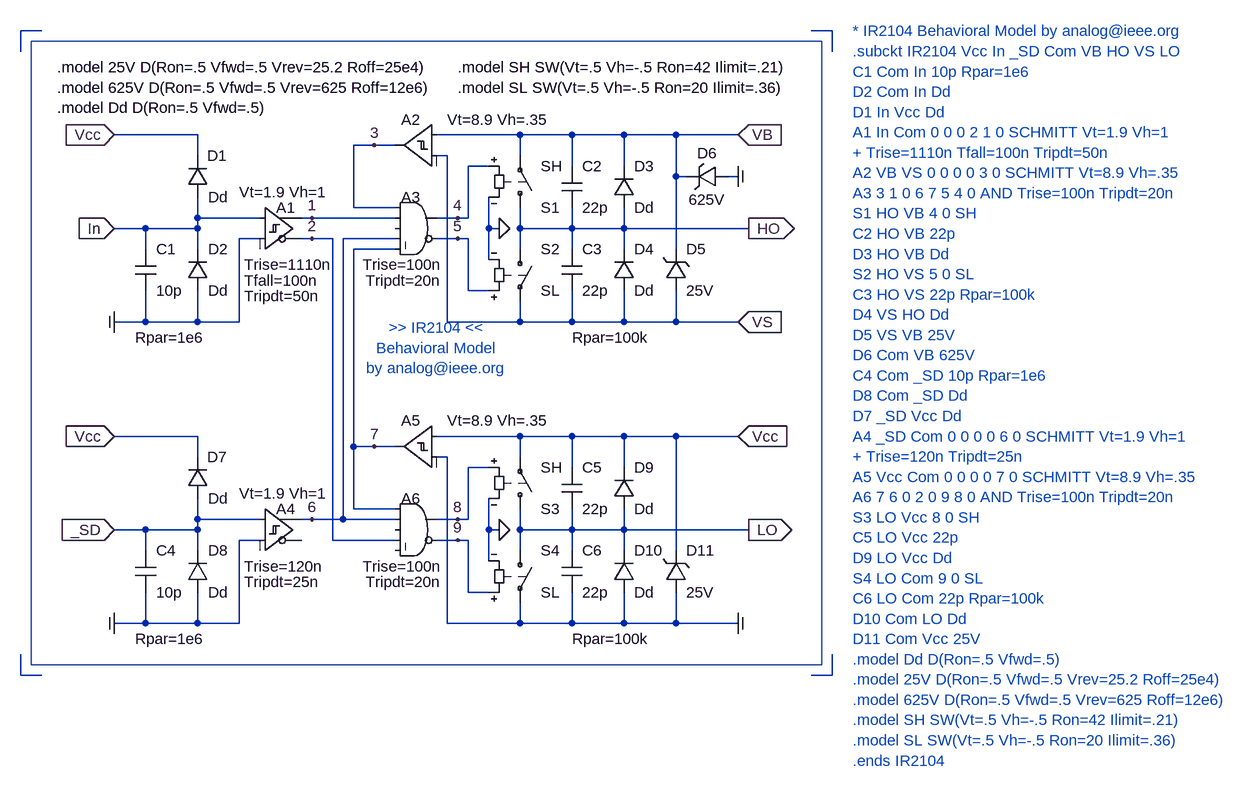
[diagram p0: schematic ir2104.asc]
ir2104.asc, the LTspice schematic file:
Version 4
SHEET 1 1888 1048
WIRE -400 -560 -400 -592
WIRE -400 400 -400 368
WIRE -368 -592 -400 -592
WIRE -368 400 -400 400
WIRE -208 -288 -256 -288
WIRE -208 -256 -208 -288
WIRE -208 -144 -256 -144
WIRE -208 -144 -208 -192
WIRE -208 176 -256 176
WIRE -208 208 -208 176
WIRE -208 320 -256 320
WIRE -208 320 -208 272
WIRE -128 -432 -256 -432
WIRE -128 -400 -128 -432
WIRE -128 -304 -128 -336
WIRE -128 -288 -208 -288
WIRE -128 -288 -128 -304
WIRE -128 -256 -128 -288
WIRE -128 -144 -208 -144
WIRE -128 -144 -128 -192
WIRE -128 32 -256 32
WIRE -128 64 -128 32
WIRE -128 160 -128 128
WIRE -128 176 -208 176
WIRE -128 176 -128 160
WIRE -128 208 -128 176
WIRE -128 320 -208 320
WIRE -128 320 -128 272
WIRE -64 -144 -128 -144
WIRE -64 -144 -64 -272
WIRE -64 320 -128 320
WIRE -64 320 -64 192
WIRE -32 -304 -128 -304
WIRE -32 -272 -64 -272
WIRE -32 160 -128 160
WIRE -32 192 -64 192
WIRE 48 -304 32 -304
WIRE 48 -272 32 -272
WIRE 48 160 32 160
WIRE 80 -272 48 -272
WIRE 80 192 80 -272
WIRE 96 160 48 160
WIRE 96 160 96 -272
WIRE 112 -320 112 -416
WIRE 112 48 112 -256
WIRE 112 144 112 48
WIRE 144 -416 112 -416
WIRE 144 48 112 48
WIRE 176 -416 144 -416
WIRE 176 -320 112 -320
WIRE 176 -304 48 -304
WIRE 176 -272 96 -272
WIRE 176 -256 112 -256
WIRE 176 48 144 48
WIRE 176 144 112 144
WIRE 176 160 96 160
WIRE 176 192 80 192
WIRE 256 -400 240 -400
WIRE 256 -144 256 -400
WIRE 256 64 240 64
WIRE 256 320 256 64
WIRE 272 -304 240 -304
WIRE 272 -272 240 -272
WIRE 272 160 240 160
WIRE 272 192 240 192
WIRE 288 -304 272 -304
WIRE 288 -304 288 -384
WIRE 288 -272 272 -272
WIRE 288 -192 288 -272
WIRE 288 160 272 160
WIRE 288 160 288 80
WIRE 288 192 272 192
WIRE 288 272 288 192
WIRE 320 -384 288 -384
WIRE 320 -288 320 -336
WIRE 320 -240 320 -288
WIRE 320 -192 288 -192
WIRE 320 80 288 80
WIRE 320 176 320 128
WIRE 320 224 320 176
WIRE 320 272 288 272
WIRE 336 -288 320 -288
WIRE 336 176 320 176
WIRE 368 -432 240 -432
WIRE 368 -400 368 -432
WIRE 368 -288 368 -320
WIRE 368 -256 368 -288
WIRE 368 -144 256 -144
WIRE 368 -144 368 -176
WIRE 368 32 240 32
WIRE 368 64 368 32
WIRE 368 176 368 144
WIRE 368 208 368 176
WIRE 368 320 256 320
WIRE 368 320 368 288
WIRE 448 -432 368 -432
WIRE 448 -384 448 -432
WIRE 448 -288 368 -288
WIRE 448 -288 448 -320
WIRE 448 -256 448 -288
WIRE 448 -144 368 -144
WIRE 448 -144 448 -192
WIRE 448 32 368 32
WIRE 448 80 448 32
WIRE 448 176 368 176
WIRE 448 176 448 144
WIRE 448 208 448 176
WIRE 448 320 368 320
WIRE 448 320 448 272
WIRE 528 -432 448 -432
WIRE 528 -384 528 -432
WIRE 528 -288 448 -288
WIRE 528 -288 528 -320
WIRE 528 -256 528 -288
WIRE 528 -144 448 -144
WIRE 528 -144 528 -192
WIRE 528 32 448 32
WIRE 528 80 528 32
WIRE 528 176 448 176
WIRE 528 176 528 144
WIRE 528 208 528 176
WIRE 528 320 448 320
WIRE 528 320 528 272
WIRE 608 -432 528 -432
WIRE 608 -368 608 -432
WIRE 608 -256 608 -368
WIRE 608 -144 528 -144
WIRE 608 -144 608 -192
WIRE 608 32 528 32
WIRE 608 208 608 32
WIRE 608 320 528 320
WIRE 608 320 608 272
WIRE 624 -368 608 -368
WIRE 704 -432 608 -432
WIRE 704 -368 688 -368
WIRE 704 -144 608 -144
WIRE 704 32 608 32
WIRE 704 320 608 320
WIRE 720 -288 528 -288
WIRE 720 176 528 176
WIRE 848 -592 816 -592
WIRE 848 -560 848 -592
WIRE 848 400 816 400
WIRE 848 400 848 368
FLAG 720 -288 HO
IOPIN 720 -288 Out
FLAG -256 -288 In
IOPIN -256 -288 In
FLAG -256 -432 Vcc
IOPIN -256 -432 In
FLAG 704 -432 VB
IOPIN 704 -432 In
FLAG 704 -144 VS
IOPIN 704 -144 In
FLAG -256 -144 Com
IOPIN -256 -144 In
FLAG 704 -368 Com
IOPIN 704 -368 In
FLAG -256 176 _SD
IOPIN -256 176 In
FLAG -256 32 Vcc
IOPIN -256 32 In
FLAG -256 320 Com
IOPIN -256 320 In
FLAG 704 32 Vcc
IOPIN 704 32 In
FLAG 704 320 Com
IOPIN 704 320 In
FLAG 720 176 LO
IOPIN 720 176 Out
FLAG 48 -304 1
FLAG 48 -272 2
FLAG 144 -416 3
FLAG 336 176 0
FLAG 336 -288 0
FLAG 144 48 7
FLAG 272 -304 4
FLAG 272 -272 5
FLAG 48 160 6
FLAG 272 160 8
FLAG 272 192 9
SYMBOL diode -144 -336 M180
WINDOW 0 31 64 Left 0
WINDOW 3 32 0 Left 0
SYMATTR InstName D1
SYMATTR Value Dd
SYMBOL diode -144 -192 M180
WINDOW 0 32 64 Left 0
WINDOW 3 32 0 Left 0
SYMATTR InstName D2
SYMATTR Value Dd
SYMBOL diode 512 -320 M180
WINDOW 0 32 64 Left 0
WINDOW 3 32 0 Left 0
SYMATTR InstName D3
SYMATTR Value Dd
SYMBOL diode 512 -192 M180
WINDOW 0 32 64 Left 0
WINDOW 3 32 0 Left 0
SYMATTR InstName D4
SYMATTR Value Dd
SYMBOL zener 592 -192 M180
WINDOW 0 32 64 Left 0
WINDOW 3 32 0 Left 0
SYMATTR InstName D5
SYMATTR Value 25V
SYMBOL cap 432 -384 R0
WINDOW 0 32 0 Left 0
WINDOW 3 32 64 Left 0
SYMATTR InstName C2
SYMATTR Value 22p
SYMBOL cap 432 -256 R0
WINDOW 0 32 0 Left 0
WINDOW 3 32 64 Left 0
WINDOW 39 16 136 Left 0
SYMATTR InstName C3
SYMATTR Value 22p
SYMATTR SpiceLine Rpar=100k
SYMBOL sw 368 -304 M180
WINDOW 0 32 16 Left 0
WINDOW 3 32 80 Left 0
SYMATTR InstName S1
SYMATTR Value SH
SYMBOL sw 368 -272 R0
WINDOW 0 32 16 Left 0
WINDOW 3 32 80 Left 0
SYMATTR InstName S2
SYMATTR Value SL
SYMBOL Digital\\diffschmtbuf 240 -480 M0
WINDOW 0 40 25 Center 0
WINDOW 3 -16 25 Right 0
SYMATTR InstName A2
SYMATTR Value Vt=8.9 Vh=.35
SYMBOL cap -224 -256 R0
WINDOW 0 32 0 Left 0
WINDOW 3 32 64 Left 0
WINDOW 39 0 136 Left 0
SYMATTR InstName C1
SYMATTR Value 10p
SYMATTR SpiceLine Rpar=1e6
SYMBOL zener 688 -352 M270
WINDOW 0 36 32 VTop 0
WINDOW 3 -4 32 VBottom 0
SYMATTR InstName D6
SYMATTR Value 625V
SYMBOL diode -144 128 M180
WINDOW 0 31 64 Left 0
WINDOW 3 32 0 Left 0
SYMATTR InstName D7
SYMATTR Value Dd
SYMBOL diode -144 272 M180
WINDOW 0 32 64 Left 0
WINDOW 3 32 0 Left 0
SYMATTR InstName D8
SYMATTR Value Dd
SYMBOL Digital\\diffschmitt -32 112 R0
WINDOW 0 40 32 Center 0
WINDOW 3 -32 8 Left 0
WINDOW 123 -24 120 Left 0
WINDOW 39 -24 144 Left 0
SYMATTR InstName A4
SYMATTR Value Vt=1.9 Vh=1
SYMATTR Value2 Trise=120n
SYMATTR SpiceLine Tripdt=25n
SYMBOL Digital\\diffschmtbuf 240 -16 M0
WINDOW 0 40 24 Center 0
WINDOW 3 -16 24 Right 0
SYMATTR InstName A5
SYMATTR Value Vt=8.9 Vh=.35
SYMBOL cap -224 208 R0
WINDOW 0 32 0 Left 0
WINDOW 3 32 64 Left 0
WINDOW 39 0 136 Left 0
SYMATTR InstName C4
SYMATTR Value 10p
SYMATTR SpiceLine Rpar=1e6
SYMBOL sw 368 160 M180
WINDOW 0 32 16 Left 0
WINDOW 3 32 80 Left 0
SYMATTR InstName S3
SYMATTR Value SH
SYMBOL sw 368 192 R0
WINDOW 0 32 16 Left 0
WINDOW 3 32 80 Left 0
SYMATTR InstName S4
SYMATTR Value SL
SYMBOL diode 512 144 M180
WINDOW 0 32 64 Left 0
WINDOW 3 32 0 Left 0
SYMATTR InstName D9
SYMATTR Value Dd
SYMBOL diode 512 272 M180
WINDOW 0 32 64 Left 0
WINDOW 3 32 0 Left 0
SYMATTR InstName D10
SYMATTR Value Dd
SYMBOL zener 592 272 M180
WINDOW 0 32 64 Left 0
WINDOW 3 32 0 Left 0
SYMATTR InstName D11
SYMATTR Value 25V
SYMBOL cap 432 80 R0
WINDOW 0 32 0 Left 0
WINDOW 3 32 64 Left 0
SYMATTR InstName C5
SYMATTR Value 22p
SYMBOL cap 432 208 R0
WINDOW 0 32 0 Left 0
WINDOW 3 32 64 Left 0
WINDOW 39 16 136 Left 0
SYMATTR InstName C6
SYMATTR Value 22p
SYMATTR SpiceLine Rpar=100k
SYMBOL Digital\\and 208 -352 R0
WINDOW 0 -8 16 Center 0
WINDOW 3 40 120 Right 0
WINDOW 123 40 144 Right 0
SYMATTR InstName A3
SYMATTR Value Trise=100n
SYMATTR Value2 Tripdt=20n
SYMBOL Digital\\and 208 112 R0
WINDOW 0 -8 16 Center 0
WINDOW 3 40 120 Right 0
WINDOW 123 40 144 Right 0
SYMATTR InstName A6
SYMATTR Value Trise=100n
SYMATTR Value2 Tripdt=20n
SYMBOL Digital\\diffschmitt -32 -352 R0
WINDOW 0 40 32 Center 0
WINDOW 3 -32 8 Left 0
WINDOW 123 -24 120 Left 0
WINDOW 39 -24 144 Left 0
WINDOW 40 -24 168 Left 0
SYMATTR InstName A1
SYMATTR Value Vt=1.9 Vh=1
SYMATTR Value2 Trise=1110n
SYMATTR SpiceLine Tfall=100n
SYMATTR SpiceLine2 Tripdt=50n
TEXT 240 -104 Center 0 ;>> IR2104 <<\nBehavioral Model\nby analog@ieee.org
TEXT -344 -536 Left 0 !.model 25V D(Ron=.5 Vfwd=.5 Vrev=25.2 Roff=25e4)\n.model 625V D(Ron=.5 Vfwd=.5 Vrev=625 Roff=12e6)\n.model Dd D(Ron=.5 Vfwd=.5)
TEXT 272 -536 Left 0 !.model SH SW(Vt=.5 Vh=-.5 Ron=42 Ilimit=.21)\n.model SL SW(Vt=.5 Vh=-.5 Ron=20 Ilimit=.36)
TEXT 880 -592 Left 0 ;* IR2104 Behavioral Model by analog@ieee.org\n.subckt IR2104 Vcc In _SD Com VB HO VS LO\nC1 Com In 10p Rpar=1e6\nD2 Com In Dd\nD1 In Vcc Dd\nA1 In Com 0 0 0 2 1 0 SCHMITT Vt=1.9 Vh=1\n+ Trise=1110n Tfall=100n Tripdt=50n\nA2 VB VS 0 0 0 0 3 0 SCHMITT Vt=8.9 Vh=.35\nA3 3 1 0 6 7 5 4 0 AND Trise=100n Tripdt=20n\nS1 HO VB 4 0 SH\nC2 HO VB 22p\nD3 HO VB Dd\nS2 HO VS 5 0 SL\nC3 HO VS 22p Rpar=100k\nD4 VS HO Dd\nD5 VS VB 25V\nD6 Com VB 625V\nC4 Com _SD 10p Rpar=1e6\nD8 Com _SD Dd\nD7 _SD Vcc Dd\nA4 _SD Com 0 0 0 0 6 0 SCHMITT Vt=1.9 Vh=1\n+ Trise=120n Tripdt=25n\nA5 Vcc Com 0 0 0 0 7 0 SCHMITT Vt=8.9 Vh=.35\nA6 7 6 0 2 0 9 8 0 AND Trise=100n Tripdt=20n\nS3 LO Vcc 8 0 SH\nC5 LO Vcc 22p\nD9 LO Vcc Dd\nS4 LO Com 9 0 SL\nC6 LO Com 22p Rpar=100k\nD10 Com LO Dd\nD11 Com Vcc 25V\n.model Dd D(Ron=.5 Vfwd=.5)\n.model 25V D(Ron=.5 Vfwd=.5 Vrev=25.2 Roff=25e4)\n.model 625V D(Ron=.5 Vfwd=.5 Vrev=625 Roff=12e6)\n.model SH SW(Vt=.5 Vh=-.5 Ron=42 Ilimit=.21)\n.model SL SW(Vt=.5 Vh=-.5 Ron=20 Ilimit=.36)\n.ends IR2104
RECTANGLE Normal 832 384 -384 -576

The netlist it stands for:
* ir2104.asc
D1 In Vcc Dd
D2 Com In Dd
D3 HO VB Dd
D4 VS HO Dd
D5 VS VB 25V
C2 VB HO 22p
C3 HO VS 22p Rpar=100k
S1 HO VB 4 0 SH
S2 HO VS 5 0 SL
A2 VB VS 0 0 0 0 3 0 SCHMITT Vt=8.9 Vh=.35
C1 In Com 10p Rpar=1e6
D6 Com VB 625V
D7 _SD Vcc Dd
D8 Com _SD Dd
A4 _SD Com 0 0 0 0 6 0 SCHMITT Vt=1.9 Vh=1 Trise=120n Tripdt=25n
A5 Vcc Com 0 0 0 0 7 0 SCHMITT Vt=8.9 Vh=.35
C4 _SD Com 10p Rpar=1e6
S3 LO Vcc 8 0 SH
S4 LO Com 9 0 SL
D9 LO Vcc Dd
D10 Com LO Dd
D11 Com Vcc 25V
C5 Vcc LO 22p
C6 LO Com 22p Rpar=100k
A3 3 1 0 6 7 5 4 0 AND Trise=100n Tripdt=20n
A6 7 6 0 2 0 9 8 0 AND Trise=100n Tripdt=20n
A1 In Com 0 0 0 2 1 0 SCHMITT Vt=1.9 Vh=1 Trise=1110n Tfall=100n Tripdt=50n
.model D D
.lib standard.dio
* >> IR2104 <<
* Behavioral Model
* by analog@ieee.org
.model 25V D(Ron=.5 Vfwd=.5 Vrev=25.2 Roff=25e4)
.model 625V D(Ron=.5 Vfwd=.5 Vrev=625 Roff=12e6)
.model Dd D(Ron=.5 Vfwd=.5)
.model SH SW(Vt=.5 Vh=-.5 Ron=42 Ilimit=.21)
.model SL SW(Vt=.5 Vh=-.5 Ron=20 Ilimit=.36)
* * IR2104 Behavioral Model by analog@ieee.org
* .subckt IR2104 Vcc In _SD Com VB HO VS LO
* C1 Com In 10p Rpar=1e6
* D2 Com In Dd
* D1 In Vcc Dd
* A1 In Com 0 0 0 2 1 0 SCHMITT Vt=1.9 Vh=1
* + Trise=1110n Tfall=100n Tripdt=50n
* A2 VB VS 0 0 0 0 3 0 SCHMITT Vt=8.9 Vh=.35
* A3 3 1 0 6 7 5 4 0 AND Trise=100n Tripdt=20n
* S1 HO VB 4 0 SH
* C2 HO VB 22p
* D3 HO VB Dd
* S2 HO VS 5 0 SL
* C3 HO VS 22p Rpar=100k
* D4 VS HO Dd
* D5 VS VB 25V
* D6 Com VB 625V
* C4 Com _SD 10p Rpar=1e6
* D8 Com _SD Dd
* D7 _SD Vcc Dd
* A4 _SD Com 0 0 0 0 6 0 SCHMITT Vt=1.9 Vh=1
* + Trise=120n Tripdt=25n
* A5 Vcc Com 0 0 0 0 7 0 SCHMITT Vt=8.9 Vh=.35
* A6 7 6 0 2 0 9 8 0 AND Trise=100n Tripdt=20n
* S3 LO Vcc 8 0 SH
* C5 LO Vcc 22p
* D9 LO Vcc Dd
* S4 LO Com 9 0 SL
* C6 LO Com 22p Rpar=100k
* D10 Com LO Dd
* D11 Com Vcc 25V
* .model Dd D(Ron=.5 Vfwd=.5)
* .model 25V D(Ron=.5 Vfwd=.5 Vrev=25.2 Roff=25e4)
* .model 625V D(Ron=.5 Vfwd=.5 Vrev=625 Roff=12e6)
* .model SH SW(Vt=.5 Vh=-.5 Ron=42 Ilimit=.21)
* .model SL SW(Vt=.5 Vh=-.5 Ron=20 Ilimit=.36)
* .ends IR2104
.backanno
.end